# Altium schematic sheet TopBoard.SchDoc
size A4; SheetNumber: 1; SheetTotal: 1
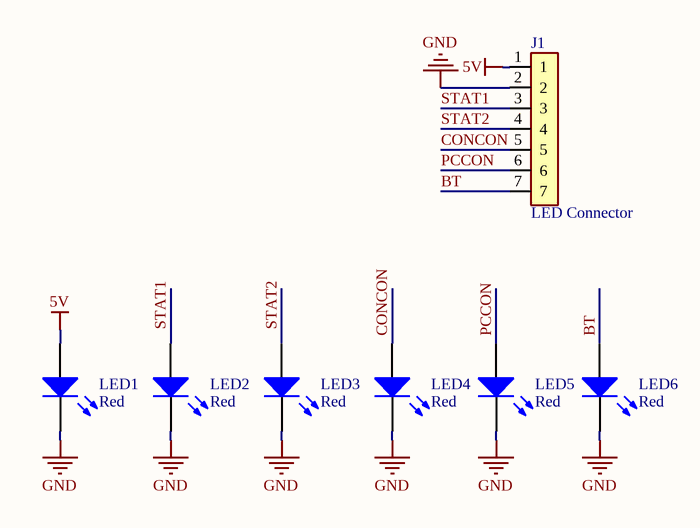
[diagram p0: TopBoard.SchDoc]

## Parts
J1  LED Connector  [HDRV7W64P0X254_1X7_1778X254X869P]
LED1  Red  [1206_A]
LED2  Red  [1206_A]
LED3  Red  [1206_A]
LED4  Red  [1206_A]
LED5  Red  [1206_A]
LED6  Red  [1206_A]

## Nets
5V: J1.1 LED1.2(A)
GND: J1.2 LED1.1(K) LED2.1(K) LED3.1(K) LED4.1(K) LED5.1(K) LED6.1(K)
BT: J1.7 LED6.2(A)
CONCON: J1.5 LED4.2(A)
PCCON: J1.6 LED5.2(A)
STAT1: J1.3 LED2.2(A)
STAT2: J1.4 LED3.2(A)

## Library data of the parts
J1 = 61300711121: Connector; Manufacturer_Name: Wurth Elektronik; Datasheet Link: http://katalog.we-online.de/em/datasheet/6130xx11121.pdf; Height: 8.69mm; Manufacturer_Part_Number: 61300711121; Mouser Part Number: 710-61300711121; Mouser Price/Stock: https://www.mouser.co.uk/ProductDetail/Wurth-Elektronik/61300711121?qs=PhR8RmCirEa4Kw6rJ18PJA%3D%3D; System: Connector
LED1-LED6 = CMP-1426-00014-1: SMD mono-color Chip LED, WL-SMCW, Green; Manufacturer: Wuerth Elektronik; PartNumber: 150120GS75000; PackageReference: 1206_A; ComponentLink1Description: Manufacturer URL; ComponentLink2URL: http://katalog.we-online.com/led/datasheet/150120GS75000.pdf; ComponentLink2Description: Datasheet; Color: Green; ComponentLink1URL: http://www.we-online.com